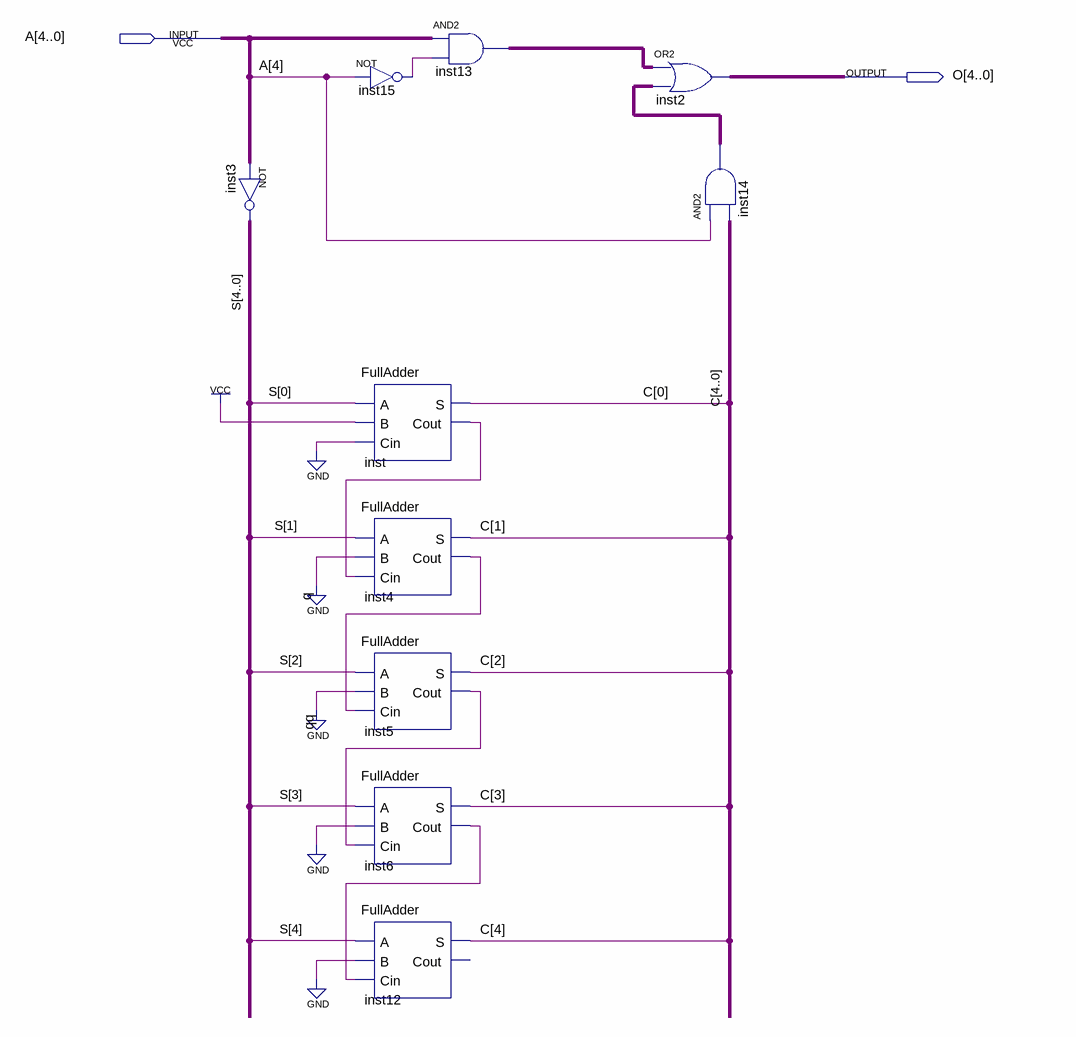
[diagram p0: schematic sheet]
// Quartus schematic ComplementoA2.bdf as structural Verilog: 10 symbols, 2 pins
module ComplementoA2 (
  input  [4:0] A,
  output [4:0] O
);

  wire inst4_cout, inst5_cout, inst6_cout, inst15_out, inst_cout;
  wire [4:0] C, inst13_out, inst14_out, S;

  assign S = ~A;  // NOT inst3, 5 bits wide
  not inst15 (inst15_out, A[4]);
  FullAdder inst (.A(S[0]), .B(1'b1), .Cin(1'b0), .S(C[0]), .Cout(inst_cout));
  FullAdder inst4 (.A(S[1]), .B(1'b0), .Cin(inst_cout), .S(C[1]), .Cout(inst4_cout));
  FullAdder inst5 (.A(S[2]), .B(1'b0), .Cin(inst4_cout), .S(C[2]), .Cout(inst5_cout));
  FullAdder inst6 (.A(S[3]), .B(1'b0), .Cin(inst5_cout), .S(C[3]), .Cout(inst6_cout));
  FullAdder inst12 (.A(S[4]), .B(1'b0), .Cin(inst6_cout), .S(C[4]));  // open: Cout
  assign inst13_out = A & {5{inst15_out}};  // AND2 inst13, 5 bits wide
  assign O = inst13_out | inst14_out;  // OR2 inst2, 5 bits wide
  assign inst14_out = {5{A[4]}} & C;  // AND2 inst14, 5 bits wide
endmodule
